# EasyEDA schematic SCH_hackpad.json

## Sheets
1 Sheet_1: TITLE: Sheet_1; REV: 1.0; Date: 2023-06-07; Sheet: 1/1; Drawn By: maximusimperiousthe723rd; Company: Your Company
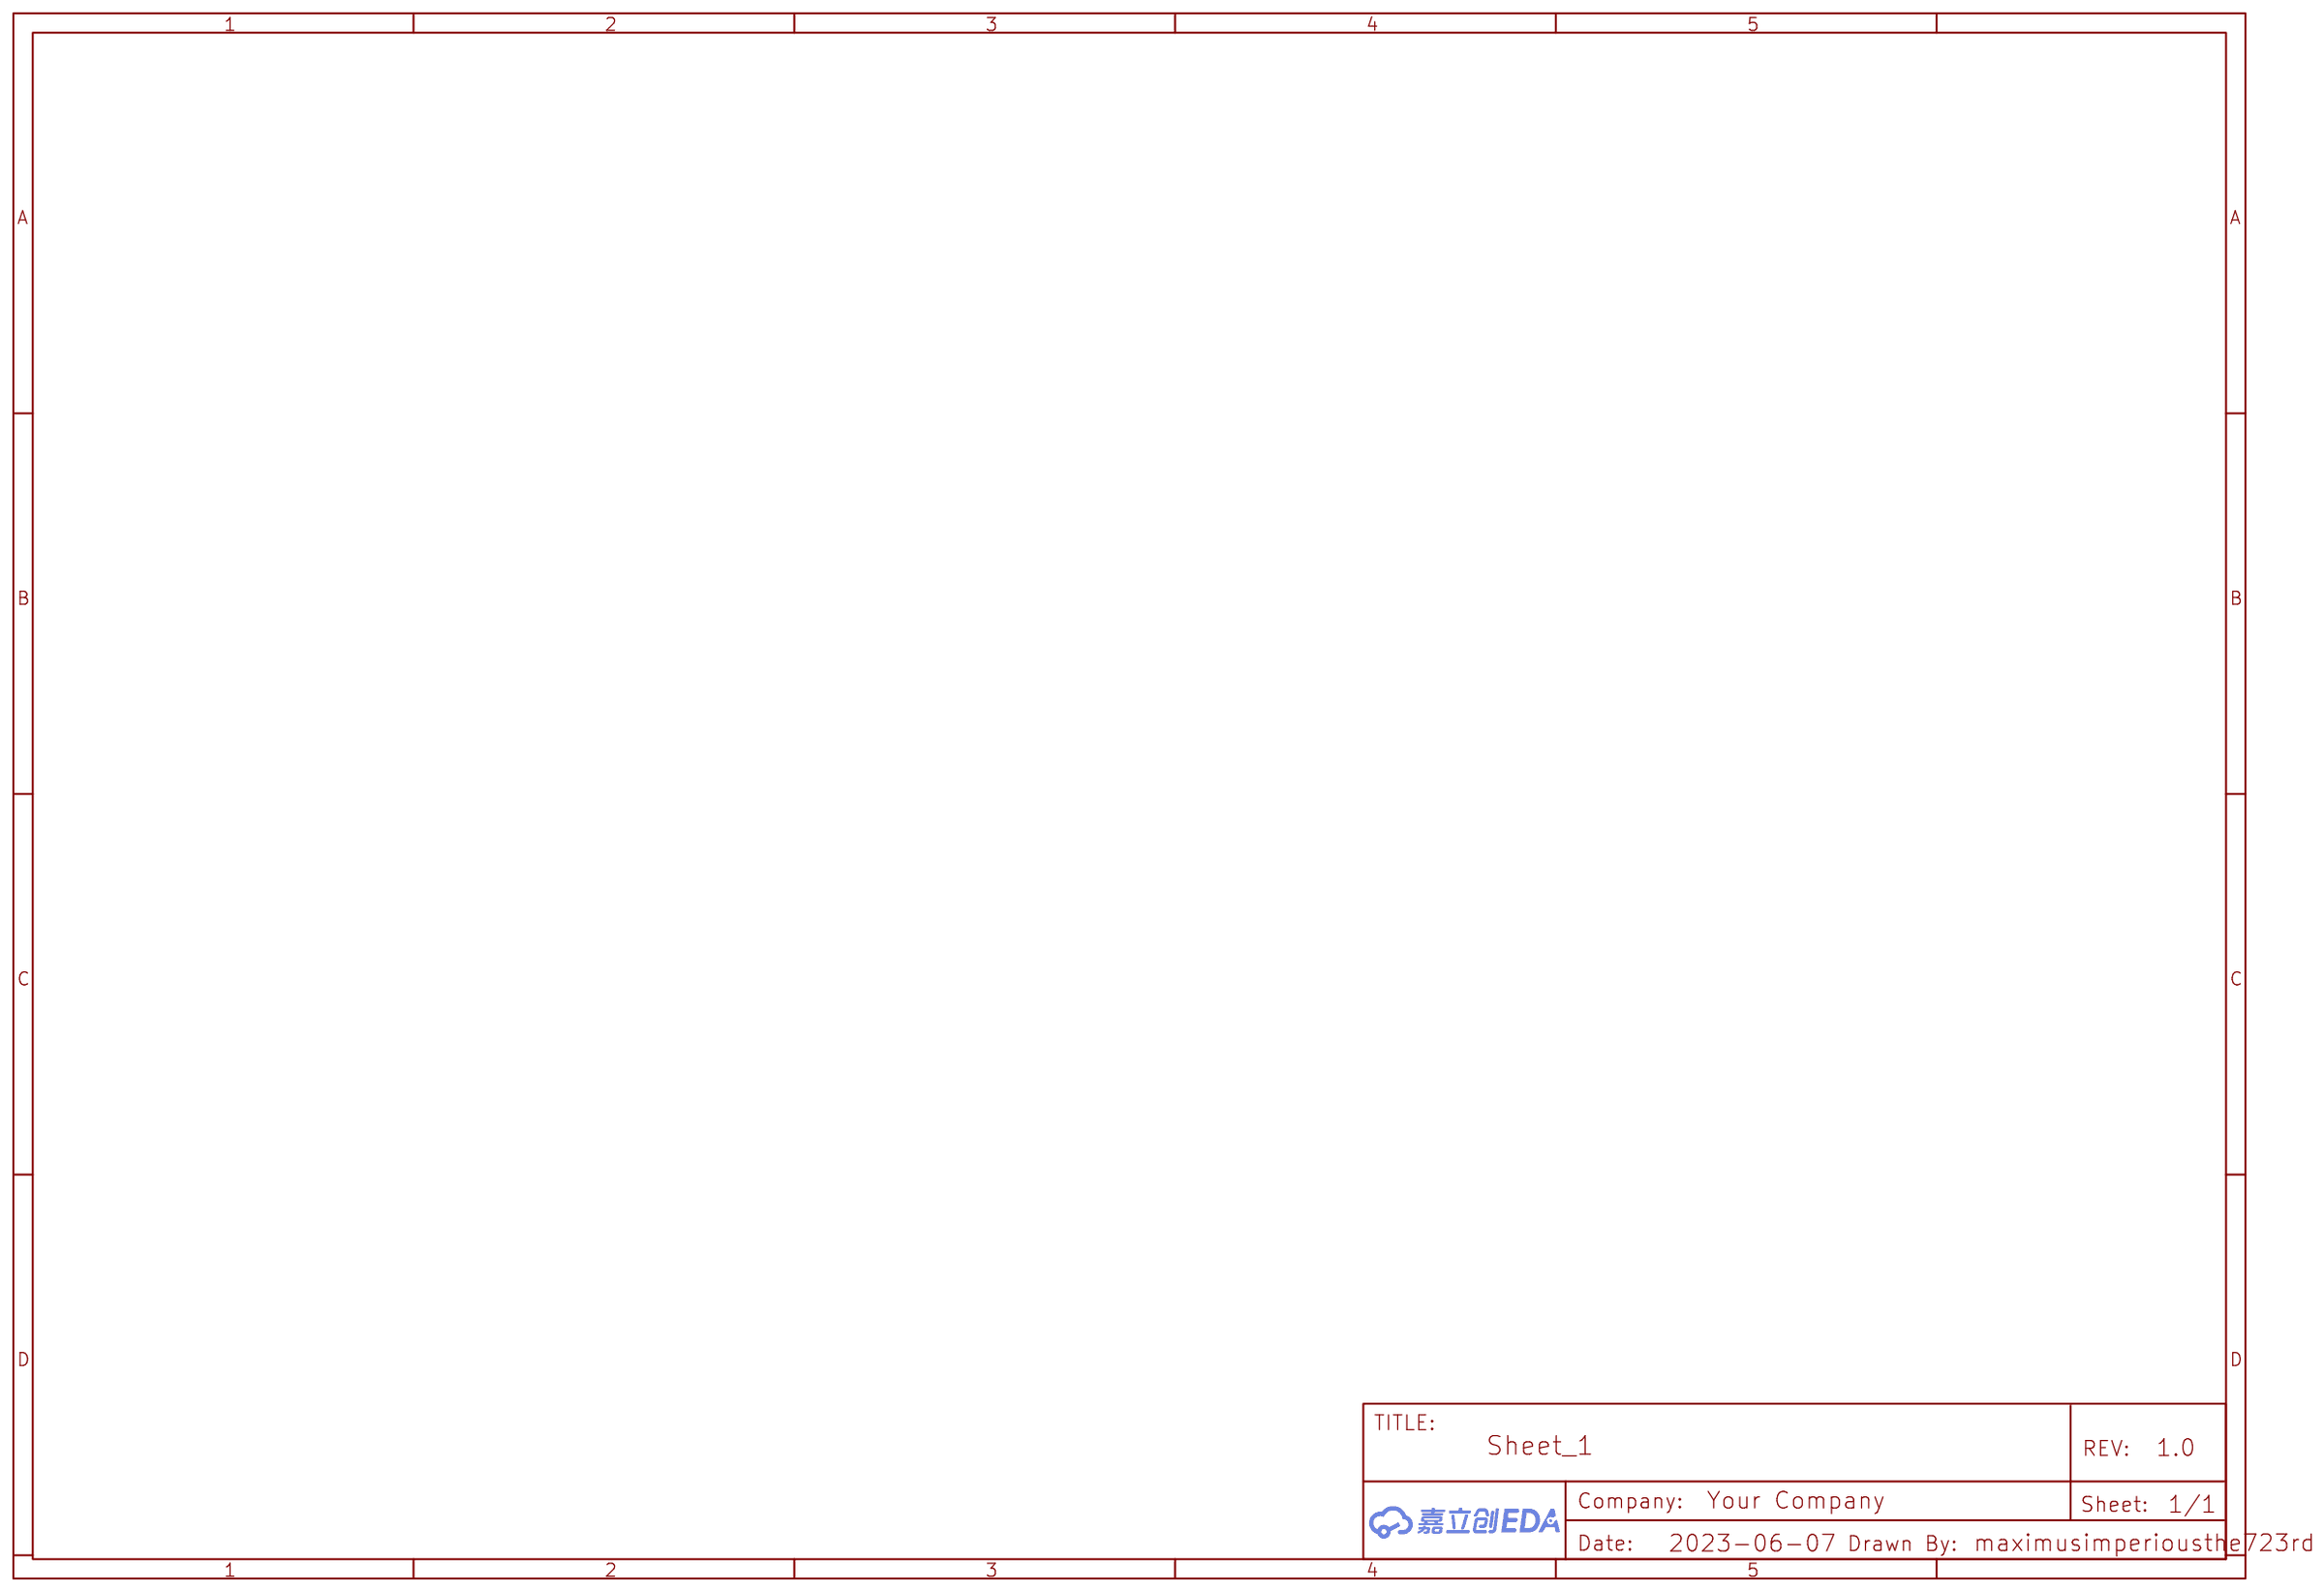
[diagram p0: Sheet_1]
2 Sheet_3: Date: 2025-02-14
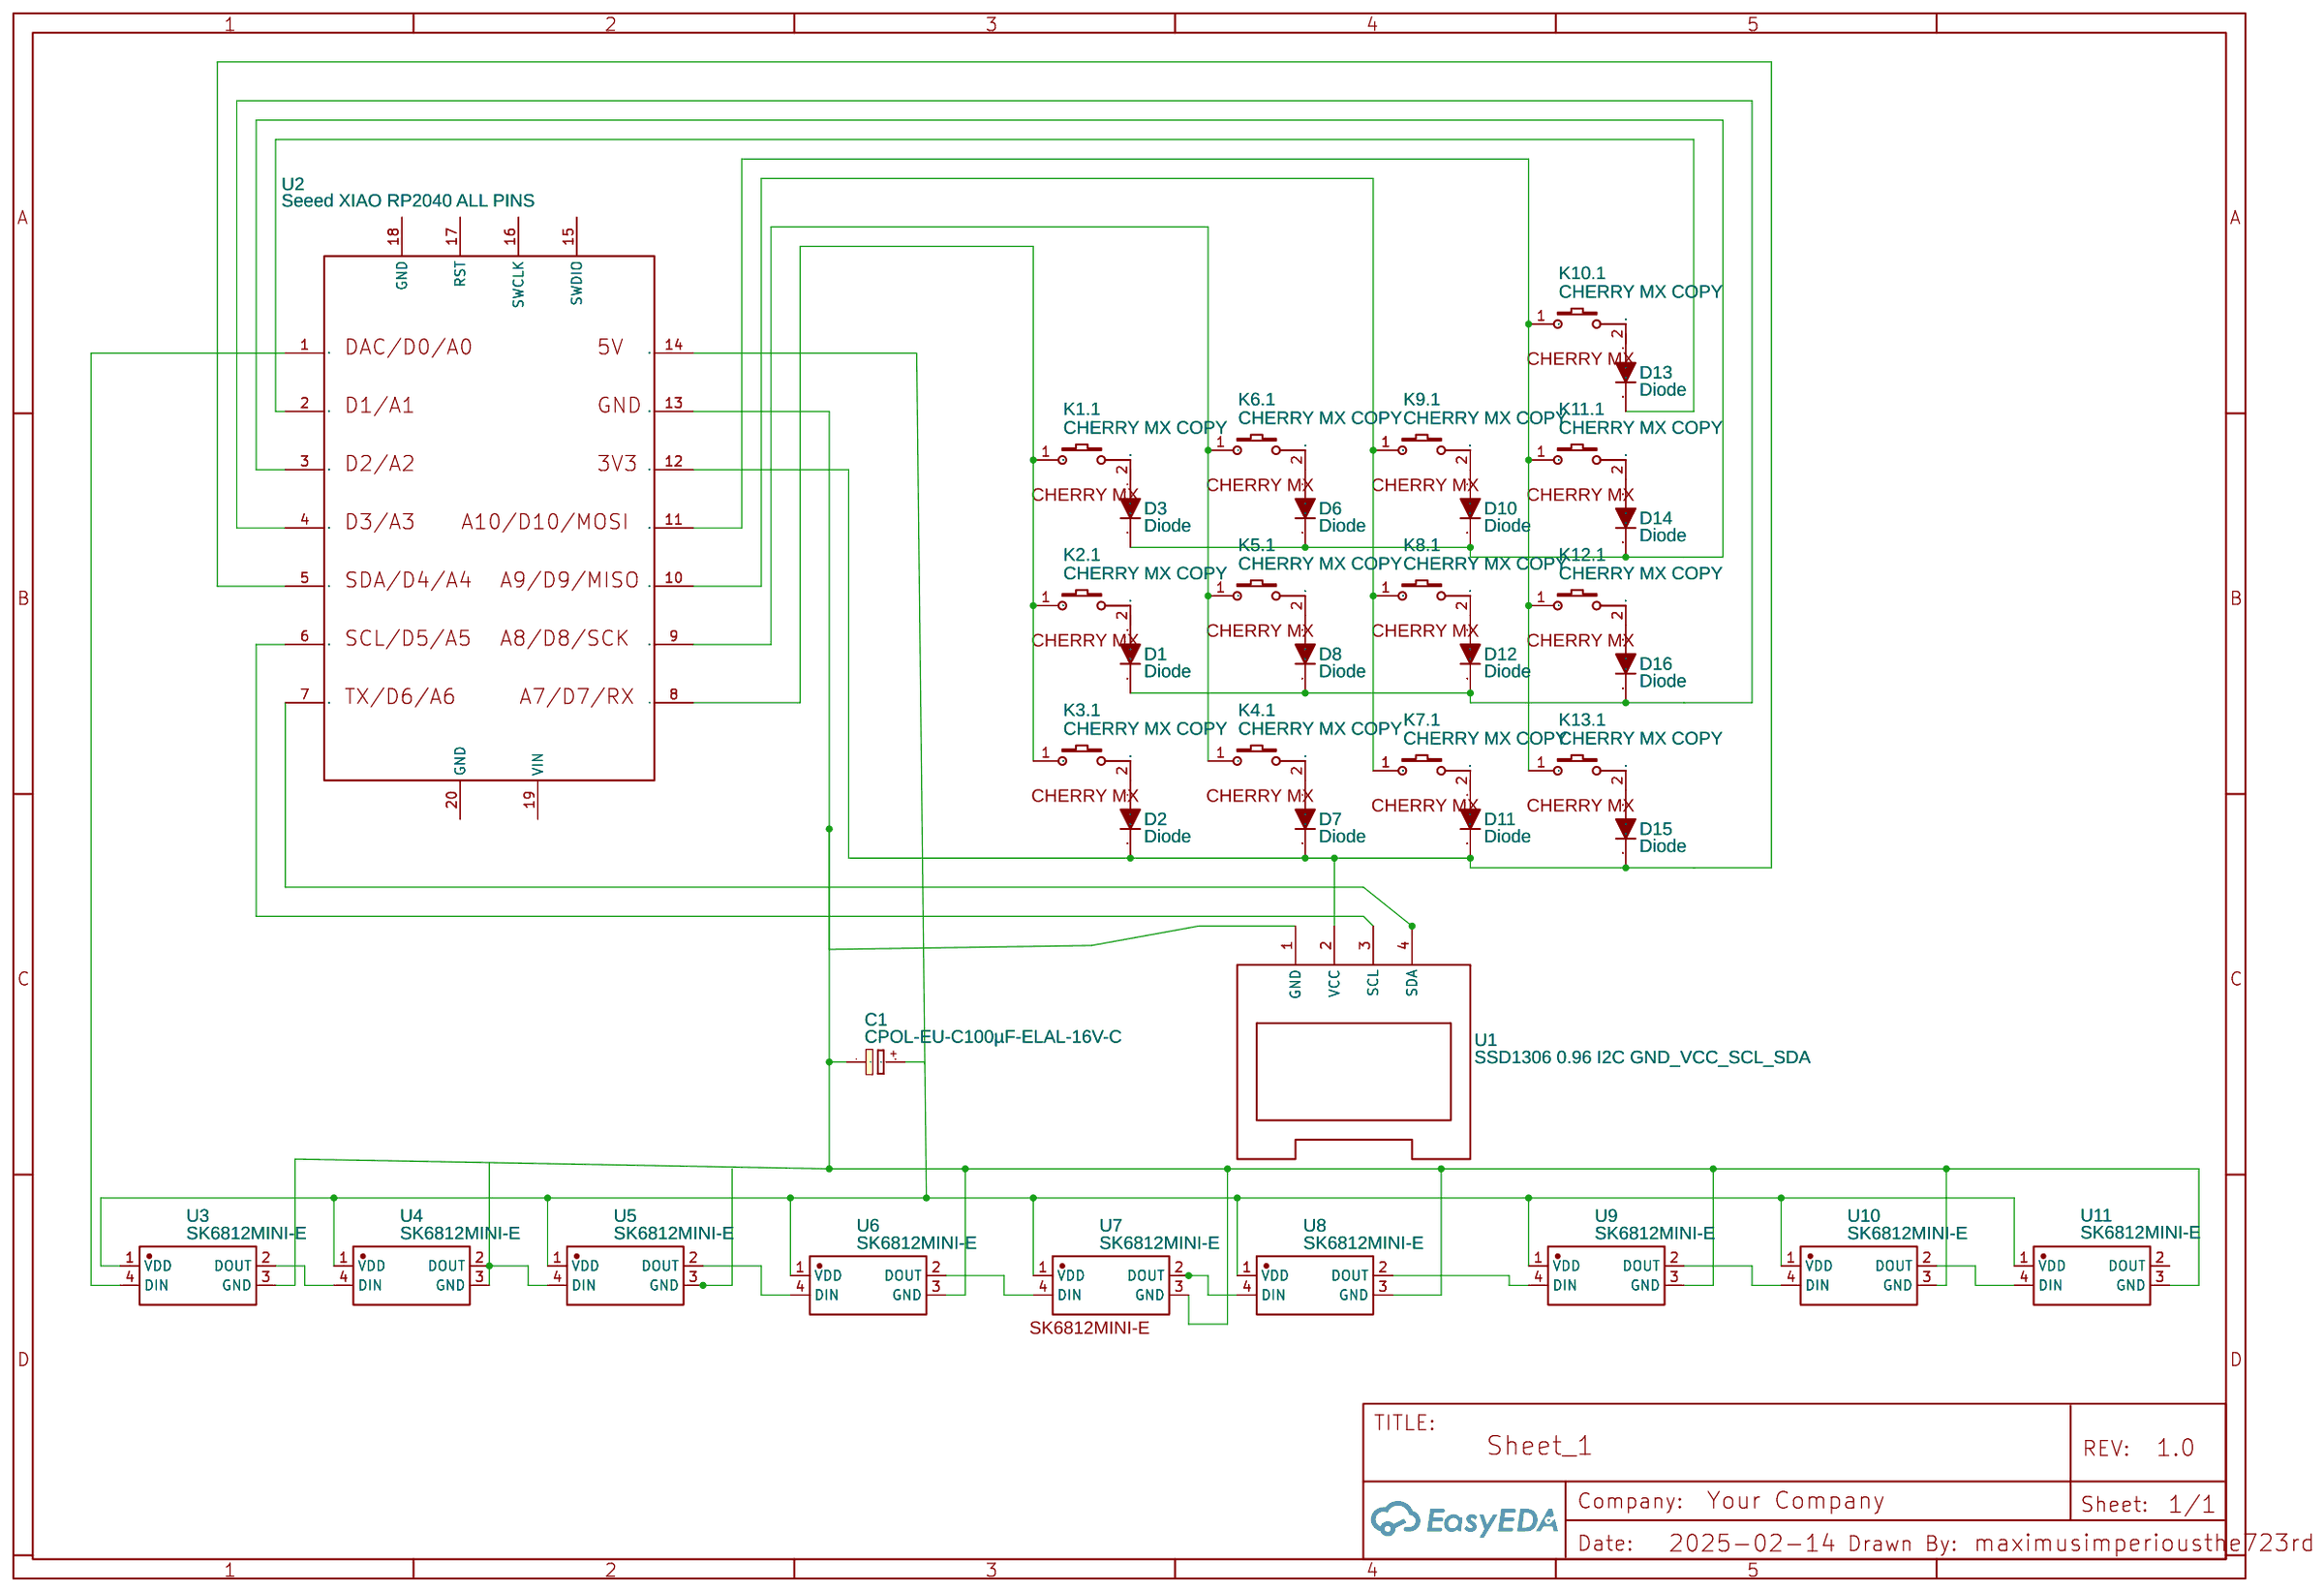
[diagram p1: Sheet_3]

## Parts
C1  CPOL-EU-C100µF-ELAL-16V-C  [PANASONIC_C]
D1  Diode  [DIODES #1]
D2  Diode  [DIODES #1]
D3  Diode  [DIODES #1]
D6  Diode  [DIODES #1]
D7  Diode  [DIODES #1]
D8  Diode  [DIODES #1]
D10  Diode  [DIODES #1]
D11  Diode  [DIODES #1]
D12  Diode  [DIODES #1]
D13  Diode  [DIODES #1]
D14  Diode  [DIODES #1]
D15  Diode  [DIODES #1]
D16  Diode  [DIODES #1]
K1  CHERRY MX COPY  [CHERRY MX]  (section 1)
K2  CHERRY MX COPY  [CHERRY MX]  (section 1)
K3  CHERRY MX COPY  [CHERRY MX]  (section 1)
K4  CHERRY MX COPY  [CHERRY MX]  (section 1)
K5  CHERRY MX COPY  [CHERRY MX]  (section 1)
K6  CHERRY MX COPY  [CHERRY MX]  (section 1)
K7  CHERRY MX COPY  [CHERRY MX]  (section 1)
K8  CHERRY MX COPY  [CHERRY MX]  (section 1)
K9  CHERRY MX COPY  [CHERRY MX]  (section 1)
K10  CHERRY MX COPY  [CHERRY MX]  (section 1)
K11  CHERRY MX COPY  [CHERRY MX]  (section 1)
K12  CHERRY MX COPY  [CHERRY MX]  (section 1)
K13  CHERRY MX COPY  [CHERRY MX]  (section 1)
U1  SSD1306 0.96 I2C GND_VCC_SCL_SDA  [SSD1306 0.96 I2C GND_VCC_SCL_SDA]
U2  Seeed XIAO RP2040 ALL PINS  [SEEED XIAO RP2040]
U3  SK6812MINI-E  [SK6812MINI-E]
U4  SK6812MINI-E  [SK6812MINI-E]
U5  SK6812MINI-E  [SK6812MINI-E]
U6  SK6812MINI-E  [SK6812MINI-E]
U7  SK6812MINI-E  [SK6812MINI-E]
U8  SK6812MINI-E  [SK6812MINI-E]
U9  SK6812MINI-E  [SK6812MINI-E]
U10  SK6812MINI-E  [SK6812MINI-E]
U11  SK6812MINI-E  [SK6812MINI-E]

## Library data of the parts
C1 = CPOL-EU-C100µF-ELAL-16V-C: Contributor: WL-Olenergies; Manufacturer Part: JBLH2101M050D090RLM 100UF 50V; Supplier: LCSC; Manufacturer: DMBJ(振宝佳); Supplier Part: C19270687
D1-D3 D6-D8 D10-D16 = Diode: Contributor: Cenatronics; Manufacturer Part: 1N4148; Supplier: LCSC; Manufacturer: null; Supplier Part: C179504
K1-K13 = CHERRY MX COPY: Contributor: Юрий Берещенко; subpart_no: 1; Package Display: Yes
U1 = SSD1306 0.96 I2C GND_VCC_SCL_SDA: Contributor: ybrdtk
U2 = Seeed XIAO RP2040 ALL PINS: Manufacturer: Seeedstudio; Manufacturer Part: 102010328; link: https://www.seeedstudio.com/Seeeduino-XIAO-Arduino-Microcontroller-SAMD21-Cortex-M0+-p-4426.html; Contributor: Derick2k
U3-U6 U8-U11 = SK6812MINI-E: Supplier: LCSC; Supplier Part: C9900001298; Manufacturer: null; JLCPCB Part Class: Extended Part; Contributor: LCSC
U7 = SK6812MINI-E: Supplier: LCSC; Supplier Part: C9900001298; Manufacturer: null; JLCPCB Part Class: Extended Part; Contributor: LCSC; Package Display: Yes

## Nets
Net-(C1--): C1.- U1.1(GND) U2.13(12) U3.3(GND) U6.3(GND) U7.3(GND) U8.3(GND) U9.3(GND) U10.3(GND) U11.3(GND)
Net-(D1-2): D1.2 D8.2 D12.2 D16.2 U2.4(3)
Net-(D2-1): D2.1 K3.2
Net-(D2-2): D2.2 D7.2 D11.2 D15.2 U1.2(VCC) U2.5(4) U2.12(11)
Net-(D3-2): D3.2 D6.2 D10.2 D14.2 U2.3(2)
Net-(D6-1): D6.1 K6.2
Net-(D7-1): D7.1 K4.2
Net-(D8-1): D8.1 K5.2
Net-(D10-1): D10.1 K9.2
Net-(D12-1): D12.1 K8.2
Net-(D13-2): D13.2 U2.2(1)
Net-(D14-1): D14.1 K11.2
Net-(D15-1): D15.1 K13.2
Net-(D16-1): D16.1 K12.2
Net-(K1.1-1): K1.1 K2.1 K3.1 U2.8(7)
Net-(K4.1-1): K4.1 K5.1 K6.1 U2.9(8)
Net-(K7.1-1): K7.1 K8.1 K9.1 U2.10(9)
Net-(K10.1-1): K10.1 K11.1 K12.1 K13.1 U2.11(10)
Net-(U1-3): U1.3(SCL) U2.6(5)
Net-(U1-4): U1.4(SDA) U2.7(6)
Net-(U2-1): U2.1(0) U3.4(DIN)
Net-(U2-14): U2.14(13) U3.1(VDD) U4.1(VDD) U5.1(VDD) U6.1(VDD) U7.1(VDD) U8.1(VDD) U9.1(VDD) U10.1(VDD) U11.1(VDD)
Net-(U3-2): U3.2(DOUT) U4.4(DIN)
Net-(U4-2): U4.2(DOUT) U4.3(GND) U5.4(DIN)
Net-(U5-2): U5.2(DOUT) U6.4(DIN)
Net-(U6-2): U6.2(DOUT) U7.4(DIN)
Net-(U7-2): U7.2(DOUT) U8.4(DIN)
Net-(U8-2): U8.2(DOUT) U9.4(DIN)
Net-(U9-2): U9.2(DOUT) U10.4(DIN)
Net-(U10-2): U10.2(DOUT) U11.4(DIN)

Not connected (* = marked no-connect by the designer): C1 +; D1 1; D3 1; D11 1; D13 1; K1 2; K2 2; K7 2; K10 2; U2 15(SWDIO) 16(SWCLK) 17(RST) 18(GND) 19(VIN) 20(GND); U5 3(GND); U11 2(DOUT)
